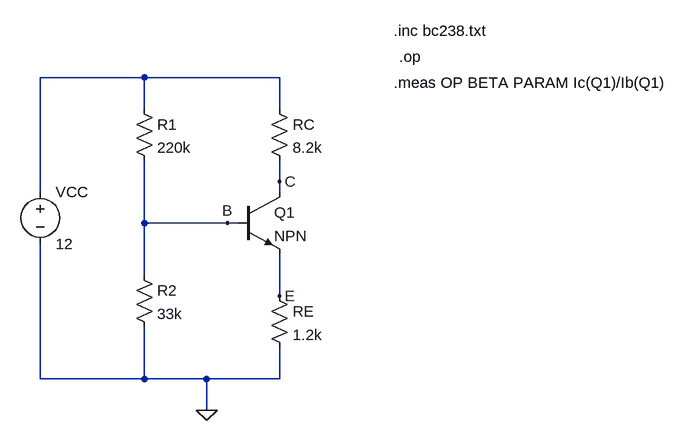
[diagram p0: schematic Draft1.asc]
Draft1.asc, the LTspice schematic file:
Version 4
SHEET 1 880 680
WIRE 48 -16 -112 -16
WIRE 256 -16 48 -16
WIRE 48 32 48 -16
WIRE 256 32 256 -16
WIRE 256 144 256 112
WIRE -112 160 -112 -16
WIRE 256 160 256 144
WIRE 48 208 48 112
WIRE 176 208 48 208
WIRE 192 208 176 208
WIRE 48 288 48 208
WIRE 256 320 256 256
WIRE -112 448 -112 240
WIRE 48 448 48 368
WIRE 48 448 -112 448
WIRE 144 448 48 448
WIRE 256 448 256 400
WIRE 256 448 144 448
WIRE 144 496 144 448
FLAG 144 496 0
FLAG 256 144 C
FLAG 176 208 B
FLAG 256 320 E
SYMBOL res 32 16 R0
SYMATTR InstName R1
SYMATTR Value 220k
SYMBOL res 32 272 R0
SYMATTR InstName R2
SYMATTR Value 33k
SYMBOL res 240 16 R0
SYMATTR InstName RC
SYMATTR Value 8.2k
SYMBOL res 240 304 R0
SYMATTR InstName RE
SYMATTR Value 1.2k
SYMBOL npn 192 160 R0
SYMATTR InstName Q1
SYMBOL voltage -112 144 R0
SYMATTR InstName VCC
SYMATTR Value 12
TEXT 432 -88 Left 2 !.inc bc238.txt
TEXT 440 -48 Left 2 !.op
TEXT 432 -8 Left 2 !.meas OP BETA PARAM Ic(Q1)/Ib(Q1)

The netlist it stands for:
* Draft1.asc
R1 N001 B 220k
R2 B 0 33k
RC N001 C 8.2k
RE E 0 1.2k
Q1 C B E 0 NPN
VCC N001 0 12
.model NPN NPN
.model PNP PNP
.lib standard.bjt
.inc bc238.txt
.op
.meas OP BETA PARAM Ic(Q1)/Ib(Q1)
.backanno
.end